# EAGLE design citysensor (EAGLE 8.6.0)
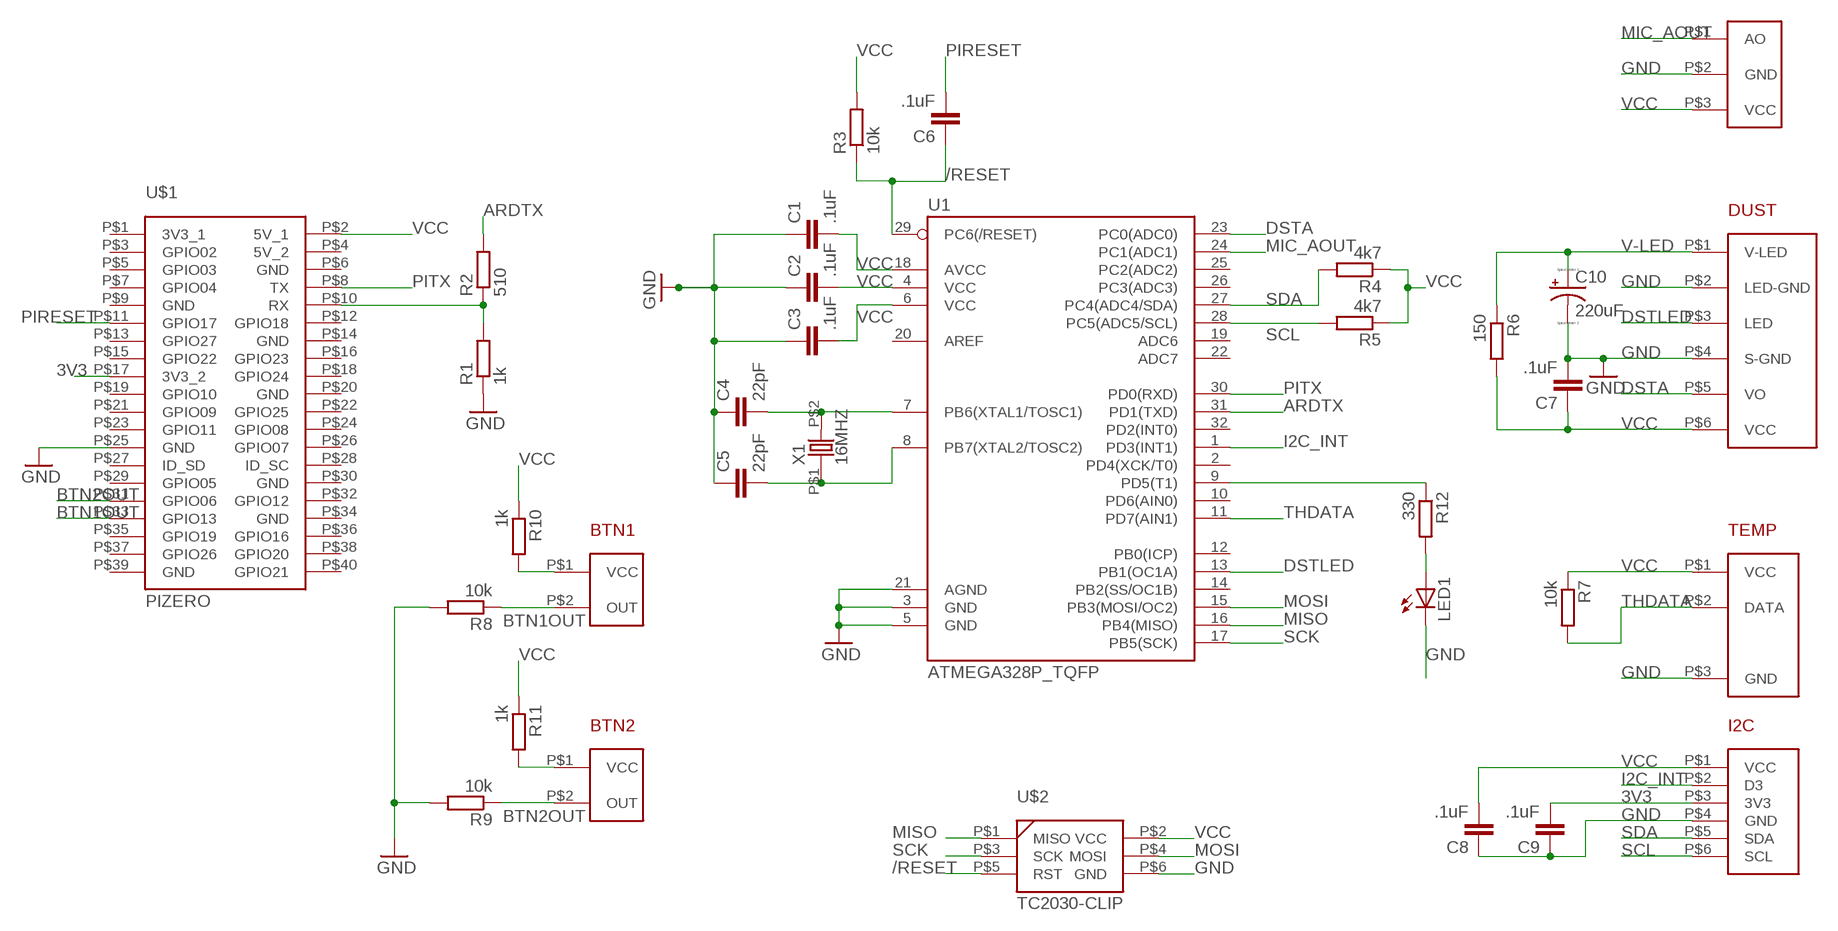
[diagram p0: schematic, sheet 1]

## Parts
BTN1  BTN  [MOLEX_2]
BTN2  BTN  [MOLEX_2]
C1  .1uF  C-EUC0805  [C0805]
C2  .1uF  C-EUC0805  [C0805]
C3  .1uF  C-EUC0805  [C0805]
C4  22pF  C-EUC0805  [C0805]
C5  22pF  C-EUC0805  [C0805]
C6  .1uF  C-EUC0805  [C0805]
C7  .1uF  C-EUC0805  [C0805]
C8  .1uF  C-EUC0805  [C0805]
C9  .1uF  C-EUC0805  [C0805]
C10  220uF  CPOL-US153CLV-0505  [153CLV-0505]
DUST  GP2Y1010AU0F  [S6B-ZR-SM4A-TF]
I2C  CON-I2C  [MOLEX_6]
LED1  LEDCHIP-LED0805  [CHIP-LED0805]
MIC  MIC  [MOLEX_3]
R1  1k  R-EU_M0805  [M0805]
R2  510  R-EU_M0805  [M0805]
R3  10k  R-EU_M0805  [M0805]
R4  4k7  R-EU_M0805  [M0805]
R5  4k7  R-EU_M0805  [M0805]
R6  150  R-EU_M0805  [M0805]
R7  10k  R-EU_M0805  [M0805]
R8  10k  R-EU_M0805  [M0805]
R9  10k  R-EU_M0805  [M0805]
R10  1k  R-EU_M0805  [M0805]
R11  1k  R-EU_M0805  [M0805]
R12  330  R-EU_M0805  [M0805]
TEMP  DHT11  [MOLEX_3]
U1  ATMEGA328P_TQFP  [TQFP32-08]
U$1  PIZERO  [PIZERO]
U$2  TC2030-CLIP  [TC2030-CLIP]
X1  16MHZ  CRYSTAL-M445  [CRYSTAL-M445]

## Nets
3V3: C9.2 I2C.P$3(3V3) U$1.P$17(3V3_2)
/RESET: C6.1 R3.1 U1.29(PC6(/RESET)) U$2.P$5(RST)
ARDTX: R2.2 U1.31(PD1(TXD))
BTN1OUT: BTN1.P$2(OUT) R8.1 U$1.P$33(GPIO13)
BTN2OUT: BTN2.P$2(OUT) R9.1 U$1.P$31(GPIO06)
DSTA: DUST.P$5(VO) U1.23(PC0(ADC0))
DSTLED: DUST.P$3(LED) U1.13(PB1(OC1A))
GND: C1.1 C2.1 C3.1 C4.1 C5.1 C7.2 C8.1 C9.1 C10.- DUST.P$2(LED-GND) DUST.P$4(S-GND) I2C.P$4(GND) LED1.C MIC.P$2(GND) R1.1 R8.2 R9.2 TEMP.P$3(GND) U1.3(GND) U1.5(GND) U1.21(AGND) U$1.P$25(GND) U$2.P$6(GND)
I2C_INT: I2C.P$2(D3) U1.1(PD3(INT1))
MIC_AOUT: MIC.P$1(AO) U1.24(PC1(ADC1))
MISO: U1.16(PB4(MISO)) U$2.P$1(MISO)
MOSI: U1.15(PB3(MOSI/OC2)) U$2.P$4(MOSI)
N$1: BTN1.P$1(VCC) R10.2
N$2: BTN2.P$1(VCC) R11.2
N$3: R12.1 U1.9(PD5(T1))
N$4: LED1.A R12.2
N$5: C4.2 U1.7(PB6(XTAL1/TOSC1)) X1.P$2
N$6: C5.2 U1.8(PB7(XTAL2/TOSC2)) X1.P$1
PIRESET: C6.2 U$1.P$11(GPIO17)
PIRX: R1.2 R2.1 U$1.P$10(RX)
PITX: U1.30(PD0(RXD)) U$1.P$8(TX)
SCK: U1.17(PB5(SCK)) U$2.P$3(SCK)
SCL: I2C.P$6(SCL) R5.2 U1.28(PC5(ADC5/SCL))
SDA: I2C.P$5(SDA) R4.2 U1.27(PC4(ADC4/SDA))
THDATA: R7.2 TEMP.P$2(DATA) U1.11(PD7(AIN1))
V-LED: C10.+ DUST.P$1(V-LED) R6.1
VCC: C1.2 C2.2 C3.2 C7.1 C8.2 DUST.P$6(VCC) I2C.P$1(VCC) MIC.P$3(VCC) R3.2 R4.1 R5.1 R6.2 R7.1 R10.1 R11.1 TEMP.P$1(VCC) U1.4(VCC) U1.6(VCC) U1.18(AVCC) U$1.P$2(5V_1) U$2.P$2(VCC)
Unconnected: U1.2(PD4(XCK/T0)) U1.10(PD6(AIN0)) U1.12(PB0(ICP)) U1.14(PB2(SS/OC1B)) U1.19(ADC6) U1.20(AREF) U1.22(ADC7) U1.25(PC2(ADC2)) U1.26(PC3(ADC3)) U1.32(PD2(INT0)) U$1.P$3(GPIO02) U$1.P$5(GPIO03) U$1.P$7(GPIO04) U$1.P$12(GPIO18) U$1.P$13(GPIO27) U$1.P$15(GPIO22) U$1.P$16(GPIO23) U$1.P$18(GPIO24) U$1.P$19(GPIO10) U$1.P$21(GPIO09) U$1.P$22(GPIO25) U$1.P$23(GPIO11) U$1.P$24(GPIO08) U$1.P$26(GPIO07) U$1.P$27(ID_SD) U$1.P$28(ID_SC) U$1.P$29(GPIO05) U$1.P$32(GPIO12) U$1.P$35(GPIO19) U$1.P$36(GPIO16) U$1.P$37(GPIO26) U$1.P$38(GPIO20) U$1.P$40(GPIO21)

## Power pins joined to a net without a drawn wire
3V3_1: U$1.P$1(3V3_1)
5V_2: U$1.P$4(5V_2)
GND: U$1.P$6(GND) U$1.P$9(GND) U$1.P$14(GND) U$1.P$20(GND) U$1.P$30(GND) U$1.P$34(GND) U$1.P$39(GND)

## Library data of the parts
BTN1 BTN2 = citysensor:BTN
C1-C9 = resistor:C-EU: CAPACITOR, European symbol
C10 = resistor:CPOL-US: POLARIZED CAPACITOR, American symbol
DUST = citysensor:GP2Y1010AU0F
I2C = citysensor:CON-I2C
LED1 = adafruit:LED: LED OSRAM: - CHIPLED LG R971, LG N971, LY N971, LG Q971, LY Q971, LO R971, LY R971 LH N974, LH R974 LS Q976, LO Q976, LY Q976 LO Q996 - Hyper CHIPLED LW Q18S LB Q993, LB Q99A, LB R99A - SideLED LS A670, LO A670, LY A670, LG A670, LP A670 LB A673, LV A673, LT A673, LW A673 LH A674 LY A675 LS A676, LA A676, LO A676, LY A676, LW A676 LS A679, LY A679, LG A679 - Hyper Micro SIDELED® LS Y876, LA Y876, LO Y876, LY Y876 LT Y87S - SmartLED LW L88C, LW L88S LB L89C, LB L89S, LG L890 LS L89K, LO L89K, LY L89K LS L896, LA L896, LO L896, LY L896 - TOPLED LS T670, LO T670, LY T670, LG T670, LP T670 LSG T670, LSP T670, LSY T670, LOP T670, LYG T670 LG T671, LOG T671, LSG T671 LB T673, LV T673, LT T673, LW T673 LH T674 LS T676, LA T676, LO T676, LY T676, LB T676, LH T676, LSB T676, LW T676 LB T67C, LV T67C, LT T67C, LS T67K, LO T67K, LY T67K, LW E67C LS E67B, LA E67B, LO E67B, LY E67B, LB E67C, LV E67C, LT E67C LW T67C LS T679, LY T679, LG T679 LS T770, LO T770, LY T770, LG T770, LP T770 LB T773, LV T773, LT T773, LW T773 LH T774 LS E675, LA E675, LY E675, LS T675 LS T776, LA T776, LO T776, LY T776, LB T776 LHGB T686 LT T68C, LB T68C - Hyper Mini TOPLED® LB M676 - Mini TOPLED Santana® LG M470 LS M47K, LO M47K, LY M47K Source: http://www.osram.convergy.de/
MIC = citysensor:MIC
R1-R12 = resistor:R-EU_: RESISTOR, European symbol
TEMP = citysensor:DHT11
U1 = SparkFun-IC-Microcontroller:ATMEGA328P_TQFP: Popular 328P in QFP Storefront component: ATmega328 - TQFP <https://www.sparkfun.com/products/13448> (COM-13448) Datasheet <http://www.sparkfun.com/datasheets/Components/SMD/ATMega328.pdf> SparkFun Products SparkFun RedBoard - Programmed with Arduino <https://www.sparkfun.com/products/12757> (DEV-12757) Arduino Pro Mini 328 - 5V/16MHz <https://www.sparkfun.com/products/11113> (DEV-11113) Arduino Pro Mini 328 - 3.3V/8MHz <https://www.sparkfun.com/products/11114> (DEV-11114) SparkFun OpenLog <https://www.sparkfun.com/products/13712> (DEV-13712) SparkFun MicroView - OLED Arduino Module <https://www.sparkfun.com/products/12923> (DEV-12923) SparkFun Digital Sandbox <https://www.sparkfun.com/products/12651> (DEV-12651) SparkFun PicoBoard <https://www.sparkfun.com/products/11888> (WIG-11888) Arduino Fio <https://www.sparkfun.com/products/10116> (DEV-10116) LilyPad Arduino 328 Main Board <https://www.sparkfun.com/products/13342> (DEV-13342) SparkFun RedStick <https://www.sparkfun.com/products/13741> (DEV-13741) LilyPad MP3 <https://www.sparkfun.com/products/11013> (DEV-11013) LilyPad Arduino SimpleSnap <https://www.sparkfun.com/products/10941> (DEV-10941) SparkFun Stepoko <https://www.sparkfun.com/products/13899> (ROB-13899) SparkFun Geiger Counter <https://www.sparkfun.com/products/11345> (SEN-11345) SparkFun EL Sequencer <https://www.sparkfun.com/products/12781> (COM-12781) Arduino Pro 328 - 5V/16MHz <https://www.sparkfun.com/products/10915> (DEV-10915) CryptoCape <https://www.sparkfun.com/products/12773> (DEV-12773) SparkFun IR Thermometer Evaluation Board - MLX90614 <https://www.sparkfun.com/products/10740> (SEN-10740) SparkFun RedBot Mainboard <https://www.sparkfun.com/products/12097> (ROB-12097) Arduino Pro 328 - 3.3V/8MHz <https://www.sparkfun.com/products/10914> (DEV-10914) SparkFun Block for Intel® Edison - Arduino <https://www.sparkfun.com/products/13036> (DEV-13036) SparkFun Simon Says - Surface Mount Soldering Kit <https://www.sparkfun.com/products/10935> (KIT-10935) SparkFun 7-Segment Serial Display - Red <https://www.sparkfun.com/products/11441> (COM-11441) SparkFun 7-Segment Serial Display - White <https://www.sparkfun.com/products/11629> (COM-11629) SparkFun 7-Segment Serial Display - Yellow <https://www.sparkfun.com/products/11443> (COM-11443) SparkFun 7-Segment Serial Display - Kelly Green <https://www.sparkfun.com/products/11440> (COM-11440) SparkFun 7-Segment Serial Display - Blue <https://www.sparkfun.com/products/11442> (COM-11442) SparkFun OpenSegment Serial Display - 20mm (Blue) <https://www.sparkfun.com/products/11647> (COM-11647) SparkFun OpenSegment Serial Display - 20mm (Green) <https://www.sparkfun.com/products/11646> (COM-11646) SparkFun OpenSegment Serial Display - 20mm (White) <https://www.sparkfun.com/products/11648> (COM-11648) SparkFun OpenSegment Serial Display - 20mm (Red) <https://www.sparkfun.com/products/11644> (COM-11644) SparkFun OpenSegment Serial Display - 20mm (Yellow) <https://www.sparkfun.com/products/11645> (COM-11645) SparkFun OpenSegment Shield <https://www.sparkfun.com/products/13190> (DEV-13190); PROD_ID: IC-09069
U$1 = citysensor:PIZERO
U$2 = citysensor:TC2030-CLIP
X1 = citysensor:CRYSTAL-M445

## Board
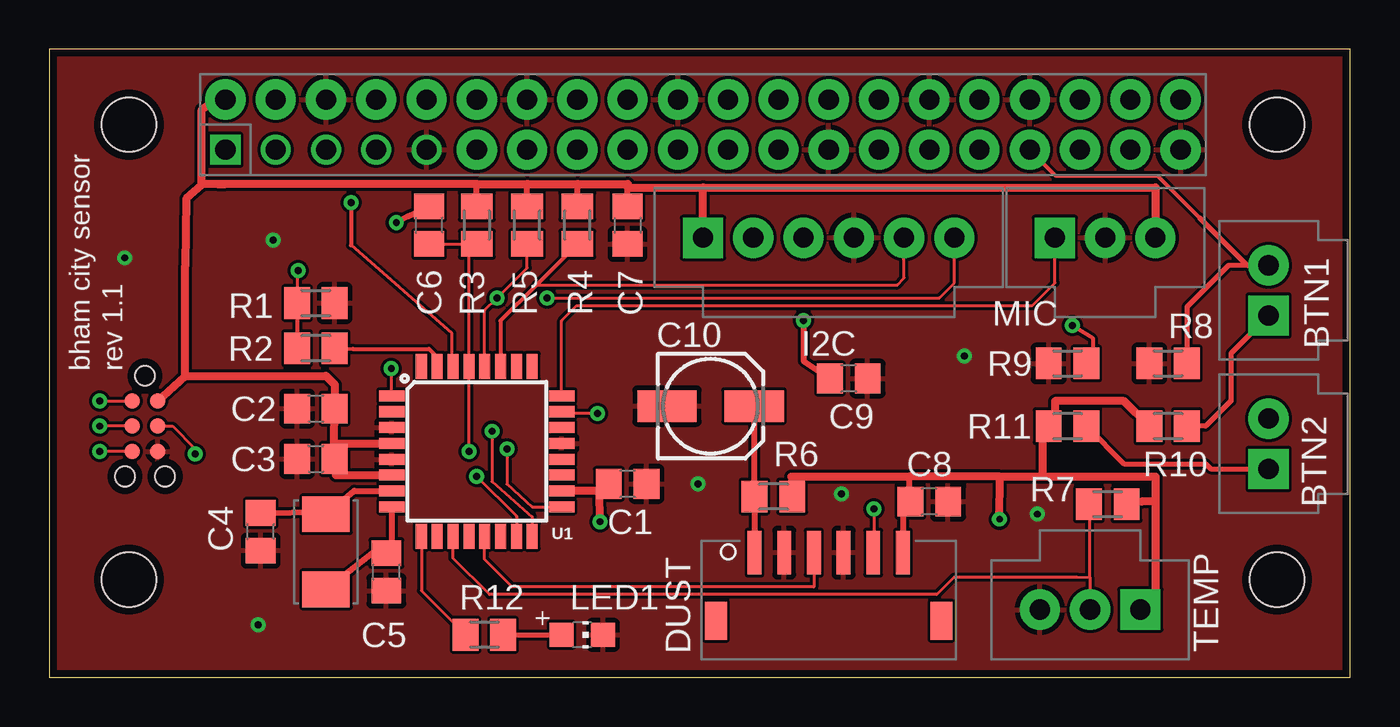
[diagram p1: board, top side]
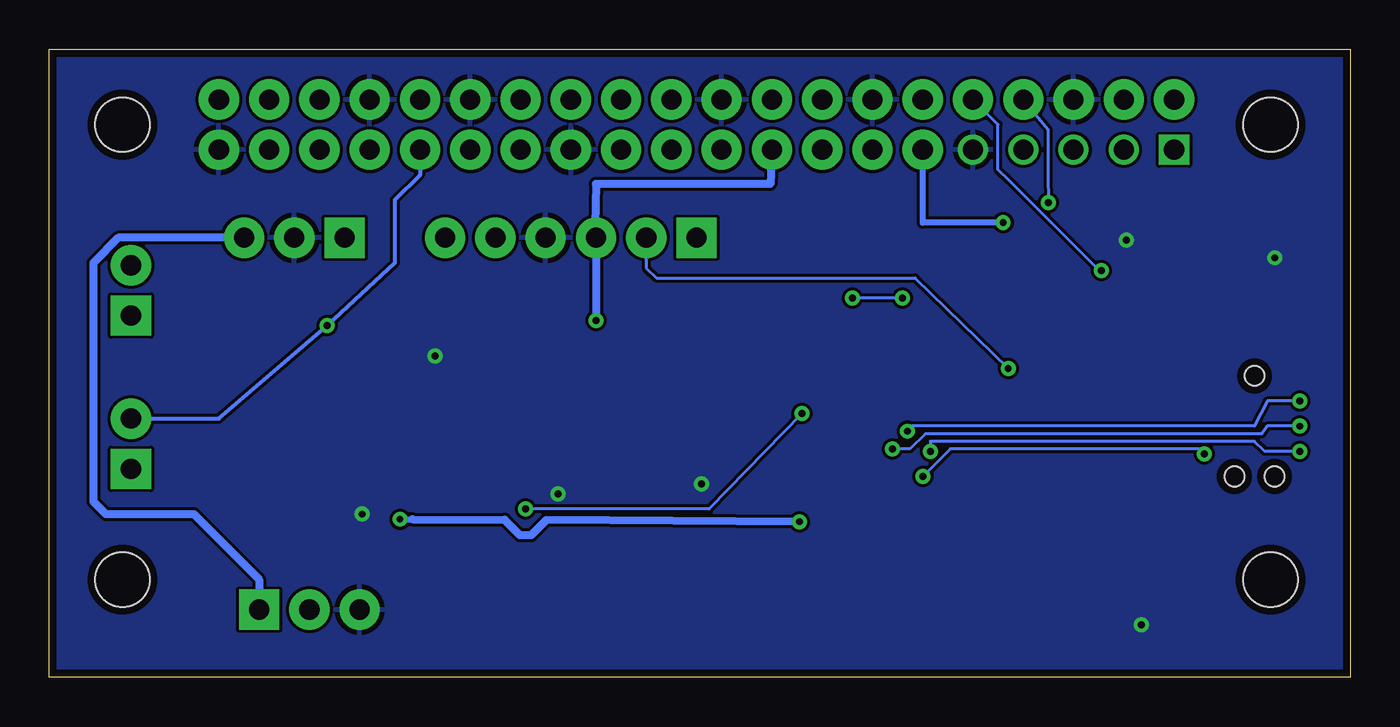
[diagram p2: board, bottom side, seen from below]

Size 65.71 x 31.74 mm. Coordinates in mm from the lower left corner, seen from the top.
Outline: 0,0 65.71,0 65.71,31.74 0,31.74 0,0
Copper layers (1*16): Top 0.035mm / dielectric 1.5mm / Bottom 0.035mm
Design rules "default *": minimum track width 6mil, minimum drill 0.35mm, track to track 6mil, track to pad 6mil, pad to pad 6mil, via to via 6mil, smd to smd 6mil, copper to edge 15mil, drill to drill 3mil, minimum pad ring 10mil, minimum via ring 8mil, stop-mask expansion 4mil, vias tented up to drill 0mil, thermal gap 10mil

### Footprints (pad centres in the part's own frame; a part is rotated, then mirrored left to right if it is on the bottom)
MOLEX_2 = drill 1.016 pad 2.032 square: P$1 1.27,0 | drill 1.016 pad 2.032: P$2 -1.27,0
C0805 = smd 1.3 x 1.5: 1 -0.95,0; 2 0.95,0
153CLV-0505 = smd 3 x 1.6: + 2.2,0; - -2.2,0
S6B-ZR-SM4A-TF = smd 0.7 x 2.2: P$1 3.75,-2.5; P$2 2.25,-2.5; P$3 0.75,-2.5; P$4 -0.75,-2.5; P$5 -2.25,-2.5; P$6 -3.75,-2.5 | smd 1.1 x 1.9: P$7 5.7,0.95; P$8 -5.7,0.95
MOLEX_6 = drill 1.016 pad 2.032 square: P$1 2.54,0 | drill 1.016 pad 2.032: P$2 0,0; P$3 -2.54,0; P$4 -5.08,0; P$5 -7.62,0; P$6 -10.16,0
CHIP-LED0805 = smd 1.2 x 1.2: A 0,-1.05; C 0,1.05
MOLEX_3 = drill 1.016 pad 2.032 square: P$1 2.54,0 | drill 1.016 pad 2.032: P$2 0,0; P$3 -2.54,0
M0805 = smd 1.3 x 1.6: 1 -0.95,0; 2 0.95,0
TQFP32-08 = smd 1.27 x 0.559: 1 -4.293,2.8; 2 -4.293,2; 3 -4.293,1.2; 4 -4.293,0.4; 5 -4.293,-0.4; 6 -4.293,-1.2; 7 -4.293,-2; 8 -4.293,-2.8; 17 4.293,-2.8; 18 4.293,-2; 19 4.293,-1.2; 20 4.293,-0.4; 21 4.293,0.4; 22 4.293,1.2; 23 4.293,2; 24 4.293,2.8 | smd 0.559 x 1.27: 9 -2.8,-4.293; 10 -2,-4.293; 11 -1.2,-4.293; 12 -0.4,-4.293; 13 0.4,-4.293; 14 1.2,-4.293; 15 2,-4.293; 16 2.8,-4.293; 25 2.8,4.293; 26 2,4.293; 27 1.2,4.293; 28 0.4,4.293; 29 -0.4,4.293; 30 -1.2,4.293; 31 -2,4.293; 32 -2.8,4.293
PIZERO = drill 1.016 pad 1.524 square: P$1 -24.13,-1.27 | drill 1.016 pad 2.032: P$2 -24.13,1.27; P$4 -21.59,1.27; P$6 -19.05,1.27; P$8 -16.51,1.27; P$10 -13.97,1.27; P$11 -11.43,-1.27; P$12 -11.43,1.27; P$13 -8.89,-1.27; P$14 -8.89,1.27; P$15 -6.35,-1.27; P$16 -6.35,1.27; P$17 -3.81,-1.27; P$18 -3.81,1.27; P$19 -1.27,-1.27; P$20 -1.27,1.27; P$21 1.27,-1.27; P$22 1.27,1.27; P$23 3.81,-1.27; P$24 3.81,1.27; P$25 6.35,-1.27; P$26 6.35,1.27; P$27 8.89,-1.27; P$28 8.89,1.27; P$29 11.43,-1.27; P$30 11.43,1.27; P$31 13.97,-1.27; P$32 13.97,1.27; P$33 16.51,-1.27; P$34 16.51,1.27; P$35 19.05,-1.27; P$36 19.05,1.27; P$37 21.59,-1.27; P$38 21.59,1.27; P$39 24.13,-1.27; P$40 24.13,1.27 | drill 1.016 pad 1.524: P$3 -21.59,-1.27; P$5 -19.05,-1.27; P$7 -16.51,-1.27; P$9 -13.97,-1.27 | hole 2.75: -29,0; 29,0; -29,-23; 29,-23
TC2030-CLIP = smd 0.787 x 0.787: P$1 1.27,-0.635; P$2 1.27,0.635; P$3 2.54,-0.635; P$4 2.54,0.635; P$5 3.81,-0.635; P$6 3.81,0.635 | hole 0.991: 0,0; 5.08,1.016; 5.08,-1.016
CRYSTAL-M445 = smd 1.8 x 2.4: P$1 -1.9,0; P$2 1.9,0

### Placement (x,y rotation side)
BTN1  61.59,19.56 270 top
BTN2  61.59,11.81 270 top
C1  29.21,9.78 180 top
C2  13.46,13.59 0 top
C3  13.46,11.05 0 top
C4  10.67,7.37 90 top
C5  17.02,5.33 90 top
C6  19.18,22.86 90 top
C7  29.21,22.86 270 top
C8  44.45,8.89 180 top
C9  40.39,15.11 180 top
C10  33.4,13.72 0 top
DUST  39.37,3.81 180 top
I2C  35.56,22.22 180 top
LED1  26.92,2.16 270 top
MIC  53.34,22.22 180 top
R1  13.46,18.92 180 top
R2  13.46,16.64 0 top
R3  21.59,22.86 90 top
R4  26.67,22.86 270 top
R5  24.13,22.86 270 top
R6  36.58,9.14 0 top
R7  53.47,8.76 180 top
R8  56.52,15.88 180 top
R9  51.44,15.88 180 top
R10  56.52,12.7 0 top
R11  51.44,12.7 0 top
R12  21.97,2.16 0 top
TEMP  52.58,3.43 0 top
U1  21.59,11.43 0 top
U$1  33.02,27.94 0 top
U$2  4.83,15.24 270 top
X1  13.97,6.35 90 top

### Tracks (layer width: path | path; a pad name or v marks a point on that pad's centre or on a via)
3V3  (via drill 0.35)
  Top 0.305: v38.1,18.03 38.1,16 C9.2
  Bottom 0.152: 38.15,22.86 I2C.P$3
  Bottom 0.406: U$1.P$17 29.29,24.94 38.1,24.94 38.15,22.86 | I2C.P$3 v38.1,18.03
/RESET  (via drill 0.35)
  Top 0.152: C6.1 R3.1 21.19,21.51 U1.29 21.19,13.59 v21.21,11.43 | U$2.P$5 v2.54,11.43
  Bottom 0.152: v2.54,11.43 4.32,11.43 4.83,11.94 21.21,11.94 v21.21,11.43
ARDTX
  Top 0.203: R2.2 15.33,16.61 19.18,16.61 19.59,16.2 U1.31
BTN1OUT
  Top 0.203: U$1.P$33 50.85,25.35 56,25.35 58.11,23.24
  Top 0.254: BTN1.P$2 60.96,20.83 60.52,20.83 | 60.52,20.83 59.56,20.83 57.47,18.73 R8.1 | 58.11,23.24 60.52,20.83
BTN2OUT  (via drill 0.35)
  Top 0.203: v51.69,17.78 52.7,17.14 52.7,15.81 R9.1
  Bottom 0.203: BTN2.P$2 57.15,13.08 v51.69,17.78 48.26,20.95 48.26,24.13 46.99,25.4 U$1.P$31
DSTA  (via drill 0.35)
  Top 0.152: v27.69,13.33 25.98,13.33 U1.23 | v41.66,8.51 DUST.P$5
  Bottom 0.152: v27.69,13.33 32.38,8.51 v41.66,8.51
DSTLED
  Top 0.152: DUST.P$3 38.62,4.58 38.61,4.57 23.37,4.57 21.97,5.97 21.97,7.12 U1.13
GND  (via drill 0.35)
  other vias: 32.77,9.78 46.23,16.26 49.91,8.26 40.01,9.27 11.3,22.1 3.81,21.21 10.54,2.67
  pour Top: -1.27,33.02 67.31,33.02 67.31,0 -1.27,0
  pour Bottom: -1.27,33.02 67.31,33.02 67.31,0 -1.27,0
I2C_INT  (via drill 0.35)
  Top 0.152: v17.27,15.62 17.27,14.22 U1.1
  Bottom 0.152: I2C.P$2 35.56,20.7 35.05,20.19 21.97,20.19 v17.27,15.62
MIC_AOUT
  Top 0.152: U1.24 25.88,18.03 26.64,18.8 49.66,18.8 50.8,19.94 MIC.P$1
MISO  (via drill 0.35)
  Top 0.152: v2.54,13.97 U$2.P$1 | v22.35,12.45 22.35,9.91 24.39,8.12 U1.16
  Bottom 0.152: v2.54,13.97 U$2.P$1 4.83,12.7 22.35,12.7 v22.35,12.45
MOSI  (via drill 0.35)
  Top 0.152: U$2.P$4 6.22,12.7 7.37,11.56 v7.37,11.3 | v21.59,10.16 23.59,8.16 U1.15
  Bottom 0.152: v7.37,11.3 7.37,11.56 20.19,11.56 v21.59,10.16
N$1
  Top 0.254: BTN1.P$1 59.69,16.38 59.69,13.97 58.42,12.7 R10.2
N$2
  Top 0.254: R11.2 54.29,10.79 58.42,10.79 58.67,10.54 BTN2.P$1
N$3
  Top 0.152: U1.9 18.79,4.39 R12.1
N$4
  Top 0.254: R12.2 LED1.A
N$5
  Top 0.152: 13.77,8.38 X1.P$2
  Top 0.305: C4.2 13.77,8.38 | X1.P$2 15.4,9.43 U1.7
N$6
  Top 0.152: 17.3,6.56 C5.2
  Top 0.305: U1.8 17.3,6.56 | C5.2 16.31,6.28 X1.P$1
PIRESET  (via drill 0.35)
  Top 0.305: C6.2 18.09,23.3 v17.53,22.99
  Bottom 0.305: v17.53,22.99 21.59,22.99 U$1.P$11
PIRX  (via drill 0.35)
  Top 0.152: v12.57,20.57 12.51,20.51 R1.2
  Top 0.203: R1.2 R2.1
  Bottom 0.152: U$1.P$10 17.78,27.94 17.78,25.65 17.24,25.15 12.67,20.57 v12.57,20.57
PITX  (via drill 0.35)
  Top 0.152: U1.30 20.32,15.79 20.32,17.4 15.24,21.84
  Top 0.203: v15.24,24 15.24,21.84 | U1.30 20.39,16.2
  Bottom 0.152: U$1.P$8 15.27,27.71 15.27,25.43 v15.24,24
SCK  (via drill 0.35)
  Top 0.152: U$2.P$3 v2.54,12.7 | v23.11,11.56 23.11,9.78 24.39,8.63 U1.17
  Bottom 0.152: v23.11,11.56 22.23,11.56 21.46,12.32 4.45,12.32 U$2.P$3 v2.54,12.7
SCL  (via drill 0.35)
  Top 0.152: U1.28 21.99,18.56 v22.61,19.18 24.13,20.7 R5.2 | v25.15,19.18 44.96,19.18 45.72,19.94 I2C.P$6
  Bottom 0.152: v22.61,19.18 v25.15,19.18
SDA
  Top 0.152: R4.2 26.67,21.59 | 24.61,19.84 42.83,19.84 43.18,20.19 I2C.P$5
  Top 0.203: R4.2 24.61,19.84 22.79,18.03 U1.27
THDATA
  Top 0.152: 52.58,8.13 52.52,8.32 R7.2 52.56,8.26 52.56,5.07 | 52.56,5.07 52.56,4.08 52.58,4.06 TEMP.P$2 | U1.11 20.39,6.03 22.23,4.19 44.83,4.19 45.72,5.08 51.92,5.08 52.56,5.07
V-LED
  Top 0.152: DUST.P$1 | 35.6,9.17 R6.1
  Top 0.305: R6.1 DUST.P$1 | C10.+ 35.6,9.17
VCC  (via drill 0.35)
  Top 0.152: 21.57,23.83 R3.2 | 24.15,23.83 R5.1 | 26.7,23.84 R4.1 | TEMP.P$1 55.05,3.5 | C8.2 43.12,8.51 | C3.2 14.48,10.23 | C1.2 28.29,9.43
  Top 0.305: 7.7,24.94 7.7,24.89 | U$1.P$2 8.38,29.13 | 55.88,4.19 TEMP.P$1 | 55.18,8.89 R7.1 | 37.47,10.16 37.47,9.72 R6.2 | 43.43,10.16 43.43,9.21 C8.2 | 43.12,8.51 DUST.P$6 | C2.2 C3.2 | 27.8,9.43 28.29,9.43 | C7.1 29.21,24.94 | R4.1 26.69,24.94 | R5.1 24.14,24.94 | R3.2 21.59,24.94
  Top 0.406: 8.38,29.13 7.7,28.7 7.7,24.94 8.89,24.94 | U$2.P$2 6.86,15.24 | 6.86,15.24 6.86,20.83 6.92,24.19 7.7,24.89 | 33.02,24.77 55.88,24.77 MIC.P$3 | 55.88,8.89 55.88,10.16 50.16,10.16 | 55.88,8.89 55.88,4.19 | 55.88,8.89 55.18,8.89 | I2C.P$1 33.02,24.77 | 48.03,10.16 50.16,10.16 | 48.03,10.16 43.43,10.16 37.47,10.16 | U1.4 14.39,11.83 C2.2 14.41,14.8 13.97,15.24 6.86,15.24 | 14.48,10.23 U1.6 | 8.46,24.94 8.89,24.94 | 8.89,24.94 21.59,24.94 24.14,24.94 26.69,24.94 29.21,24.94 29.21,24.77 33.02,24.77 | U1.18 27.8,9.43 v27.81,7.87 | v48.01,8 48.03,10.16 | 50.16,10.16 50.16,12.38 R11.1 50.8,13.01 50.8,13.97 54.3,13.97 R10.1
  Bottom 0.305: v48.01,8 47.37,8
  Bottom 0.406: v27.81,7.87 40.6,7.96 41.37,7.19 41.94,7.19 42.72,7.97 47.37,8 | MIC.P$3 62.23,22.22 63.5,20.95 63.5,8.89 62.87,8.26 58.42,8.26 55.12,4.95 TEMP.P$1

### Text on the board
tNames: bham city sensor | rev 1.1
tDocu: X1